# Altium schematic sheet AstableMultivibrator.SchDoc
size A; SheetNumber: 3; SheetTotal: 5
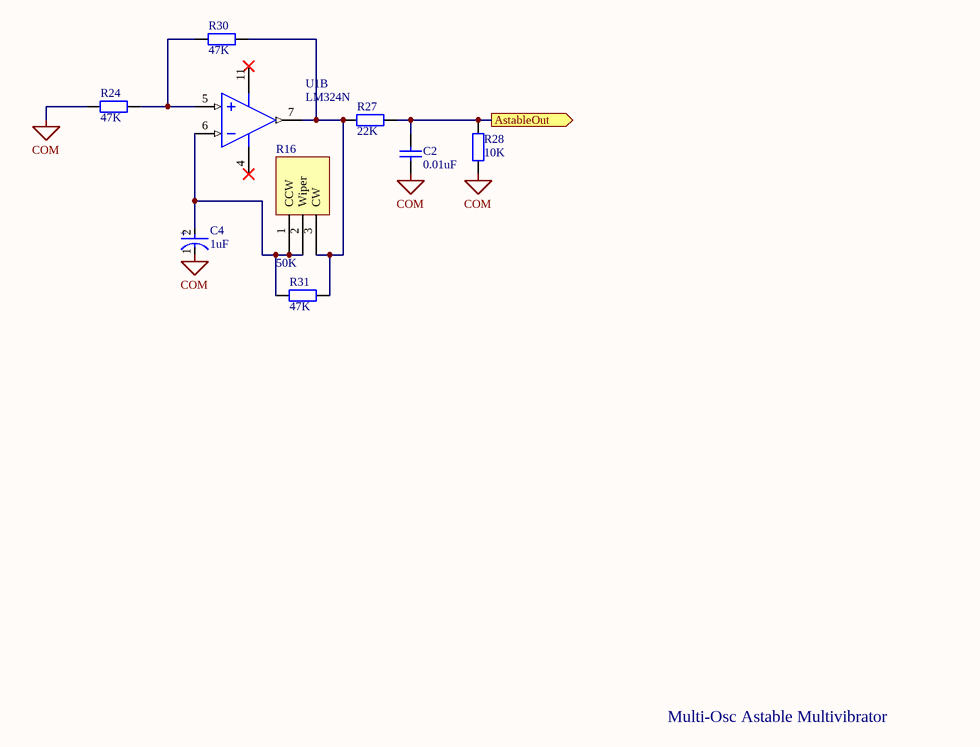
[diagram p0: AstableMultivibrator.SchDoc]

## Parts
C2  0.01uF  [KEMT-C315-THT-2]
C4  1uF  [FP-ESLE3-MFG]
R16  50K  [TrimmerPot]
R24  47K  [AXIAL-0.4]
R27  22K  [AXIAL-0.4]
R28  10K  [AXIAL-0.4]
R30  47K  [AXIAL-0.4]
R31  47K  [AXIAL-0.4]
U1  LM324N  [N0014A]  (part B of 4)

## Ports
AstableOut (out)

## Nets
COM: C2.2 C4.1(C) R24.1 R28.2
AstableOut: C2.1 R27.2 R28.1 ; port AstableOut
NetC4_2: C4.2(A) R16.1(CCW) R16.2(Wiper) R31.2 U1.6(IN2-)
NetR16_3: R16.3(CW) R27.1 R30.1 R31.1 U1.7(OUT2)
NetR24_2: R24.2 R30.2 U1.5(IN2+)

Not connected (* = marked no-connect by the designer): U1 4(V+)* 11(GND)*

## Notes on the sheet
- Multi-Osc Astable Multivibrator
- (in symbol CMP-03015-000004-1) +

## Library data of the parts
C2 = CMP-1664-00007-1: Capacitor, Ceramic, 0.01 uF, +/- 10%, 100 V, X7R, -55 to 125 degC, 2-Pin THD, RoHS, Bulk; Output Voltage: 70 V; Case\Package: PDIP; Forward Current: 60 mA; Nominal Vf: 1.3 V; Forward Voltage: 1.5 V; Channels: 2; Max Power Dissipation: 400 mW; Vce Max: 500 mV; ComponentLink1Description: Manufacturer URL; ComponentLink2Description: Datasheet; Packaging: Rail/Tube; RoHSCompliant: true; Package Quantity: 2000; PackageReference: C315-THT-2; Min Operating Temperature: -55 degC; Max Operating Temperature: 100 degC; Radiation Hardening: No; ComponentLink1URL: http://www.kemet.com/; DatasheetVersion: Aug-16; Pins: 16; PackageDescription: 2-Pin Through Hole Device, Body 3.81 x 2.54 mm; REACH SVHC: Unknown; Mount: Through Hole; ComponentLink2URL: http://capacitoredge.kemet.com/capedge2/DataSheet/Datasheet-C315C103K1R5TA.pdf?pn=C315C103K1R5TA{BULK}
C4 = CMP-03015-000004-1: CAP ALUM 10UF 20% 100V THRU HOLE; Manufacturer Part Number: ESL106M100AE3AA; Manufacturer: kemet; Life: 10000Hours; Ripple Current: 280mA; Dissipation Factor: 9%; Esr: 0.68Ω; Leakage Current: 10uA; Material: Aluminum; Tolerance: 20%; Voltage Rating: 100V; Device Class L3: Aluminum Electrolytic Capacitors; Value: 10uF; Height: 12.5mm; Temperature Range High: +105°C; Capacitance: 10uF; ComponentLink2Description: Datasheet; Mouser Description: Cap, 10UF, 100V, Alu Elec, Radial; Category: Cap; Octopart: https://octopart.com/esl106m100ae3aa-kemet-84758885; Temperature: -40°C to +105°C; RoHS: TRUE; Device Class L1: Passive Components; Digikey Description: CAP ALUM 10UF 20% 100V THRU HOLE; ComponentLink2URL: https://content.kemet.com/datasheets/KEM_A4074_ESL.pdf; Device Class L2: Capacitors; Temperature Range Low: -40°C; Package: ESLE3; Automotive: No; Lead Free: Yes
R16 = TrimmerPot
R24 R27 R28 R30 R31 = Res2: Resistor; Value: 1K; Published: 8-Jun-2000; LatestRevisionDate: 17-Jul-2002; LatestRevisionNote: Re-released for DXP Platform.; PackageReference: AXIAL-0.4; Publisher: Altium Limited; PackageDescription: Axial Device, Thru-Hole; 2 Leads; 0.4 in Pin Spacing
U1 = CMP-0055-00082-3: Low Power Quad Operational Amplifier, 14-pin MDIP; Manufacturer: Texas Instruments; CompType: Amplifiers; PowerWise: N; PackageTopMarking: NSUZXYYTTE#*LM324N; PackageDescription: MDIP, .750 x .250 x.130in, 14 Lead, .100in Pitch; Package Reference: N0014A; RoHS: N; Code_JEDEC: MS-001-AA; ComponentLink1URL: http://www.ti.com/general/docs/lit/getliterature.tsp?genericPartNumber=LM324&fileType=pdf; ComponentLink1Description: Datasheet URL; PinCount: 14